# EAGLE schematic FlightControl (EAGLE 6.5.0)
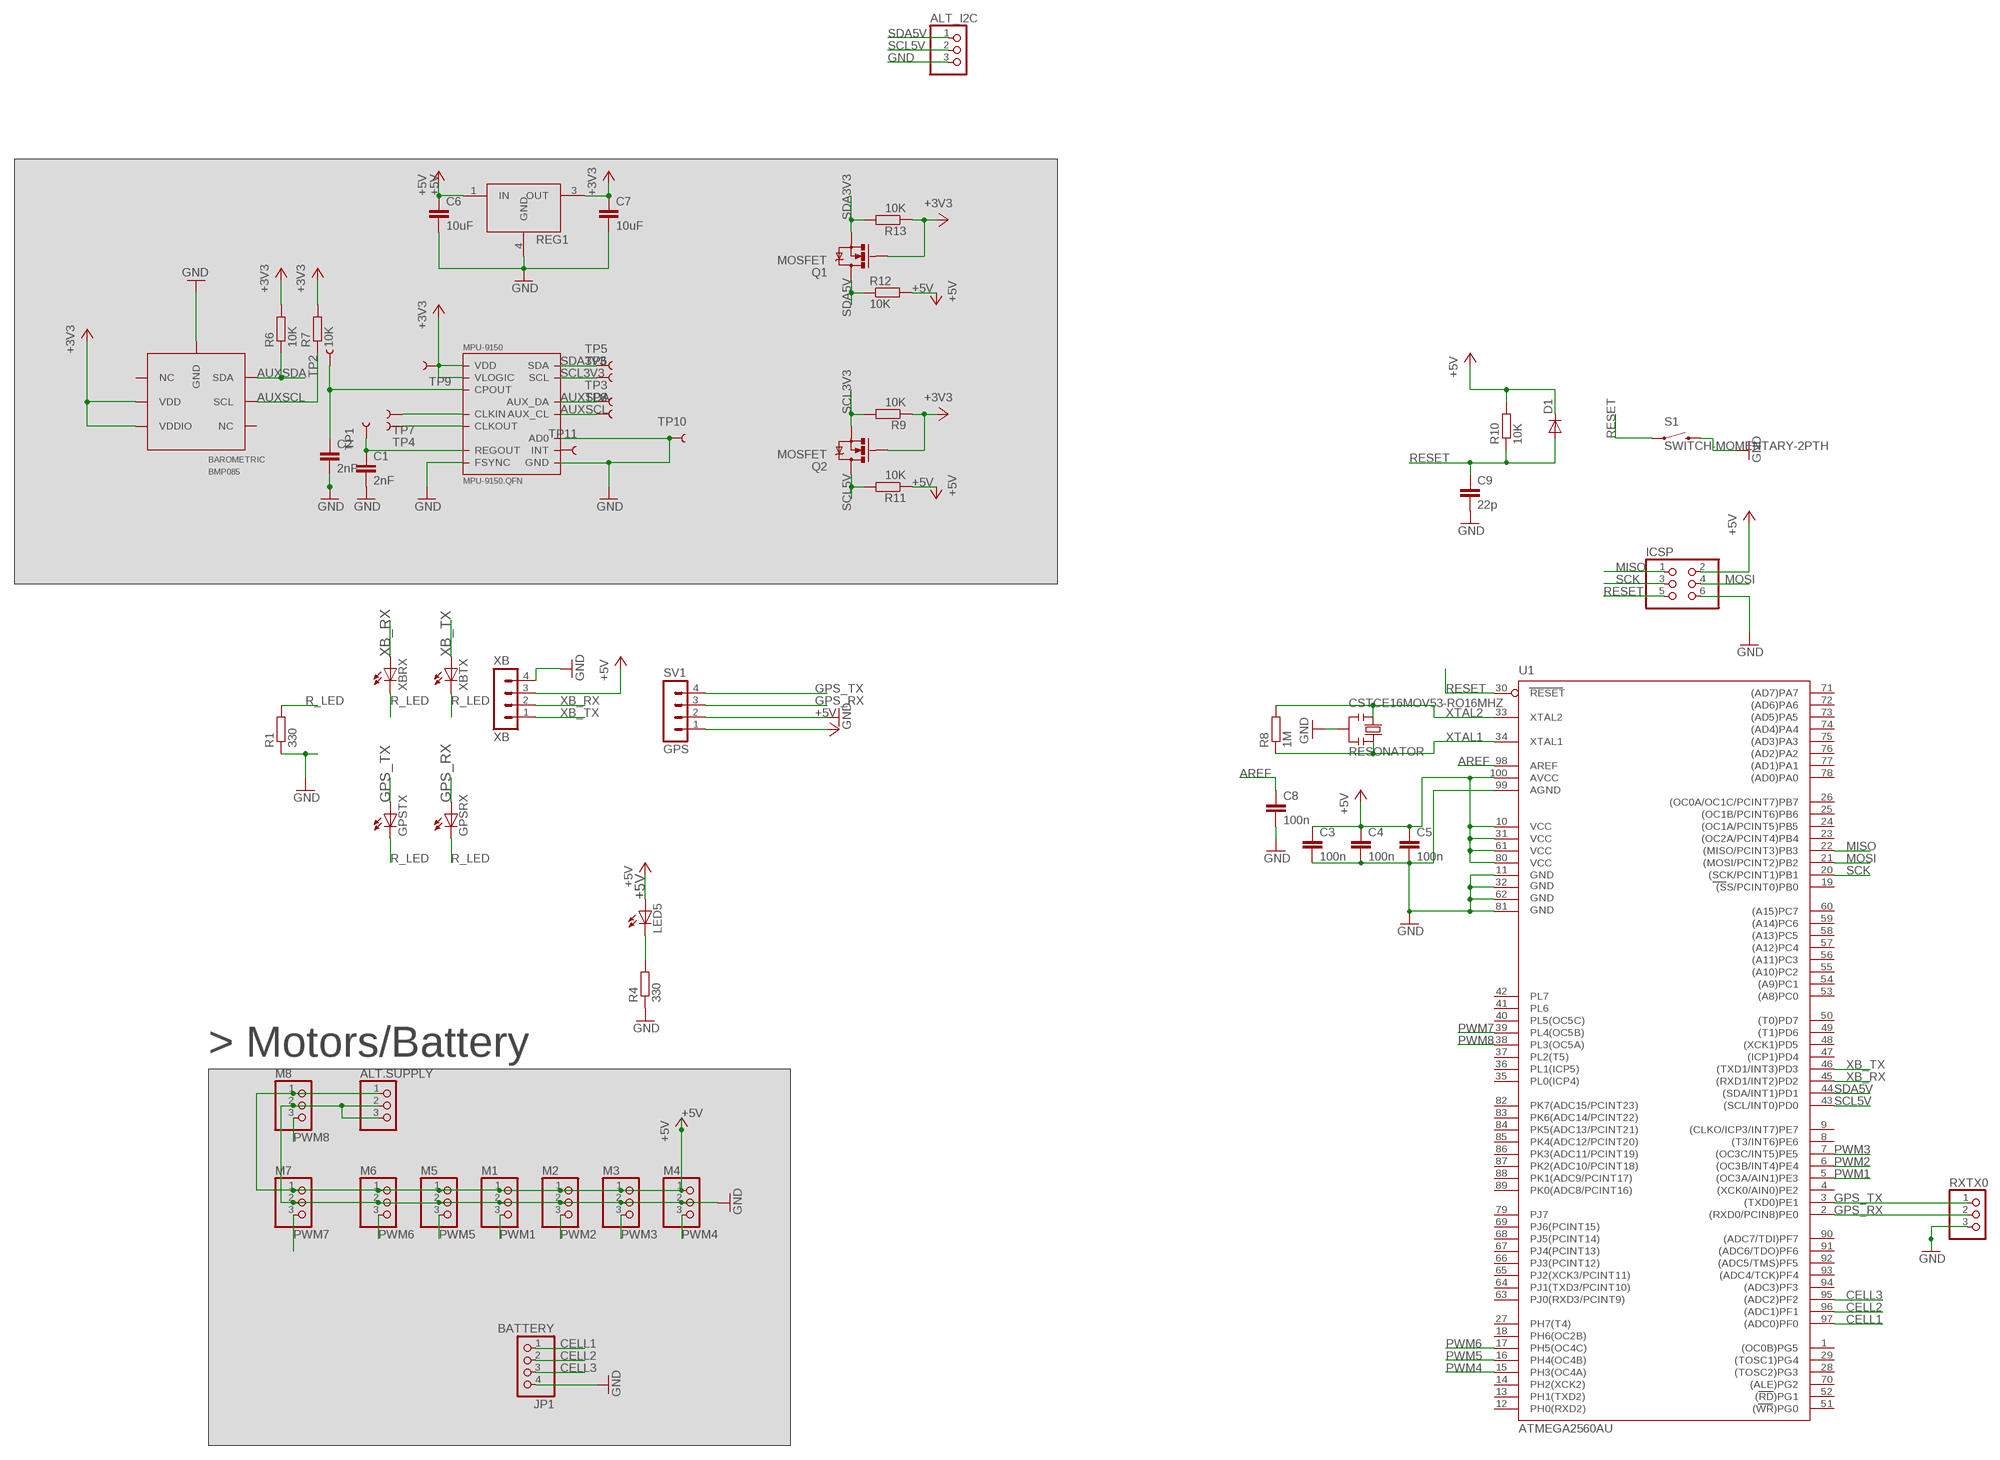
[diagram p0: schematic, sheet 1]

## Parts
ALT.SUPPLY  PINHD-1X3  [1X03]
ALT_I2C  PINHD-1X3  [1X03]
BAROMETRIC  BMP085  [7LGA]
BATTERY  JP1  PINHD-1X4  [1X04]
C1  2nF  C-EUC0603  [C0603-ROUND]
C2  2nF  C-EUC0603  [C0603-ROUND]
C3  100n  C-EU0603-RND  [C0603-ROUND]
C4  100n  C-EU0603-RND  [C0603-ROUND]
C5  100n  C-EU0603-RND  [C0603-ROUND]
C6  10uF  CAPEZ  [CAP-PTH-SMALLEZ]
C7  10uF  CAPEZ  [CAP-PTH-SMALLEZ]
C8  100n  C-EU0603-RND  [C0603-ROUND]
C9  22p  C-EU0603-RND  [C0603-ROUND]
CSTCE16MOV53-RO16MHZ  RESONATOR  RESONATORMU  [RESONATOR]
D1  DIODE-MINIMELF  [MINIMELF]
GPSRX  LEDCHIPLED_1206  [CHIPLED_1206]
GPSTX  LEDCHIPLED_1206  [CHIPLED_1206]
ICSP  PINHD-2X3  [2X03]
LED5  LEDCHIPLED_1206  [CHIPLED_1206]
M1  PINHD-1X3  [1X03]
M2  PINHD-1X3  [1X03]
M3  PINHD-1X3  [1X03]
M4  PINHD-1X3  [1X03]
M5  PINHD-1X3  [1X03]
M6  PINHD-1X3  [1X03]
M7  PINHD-1X3  [1X03]
M8  PINHD-1X3  [1X03]
MPU-9150  MPU-9150.QFN  [QFN.24.4X4]
Q1  MOSFET  MOSFET-NCHANNELBSS138  [SOT23]
Q2  MOSFET  MOSFET-NCHANNELBSS138  [SOT23]
R1  330  R-EU_0603-RND  [R0603-ROUND]
R4  330  R-EU_0603-RND  [R0603-ROUND]
R6  10K  R-EU_0603-RND  [R0603-ROUND]
R7  10K  R-EU_0603-RND  [R0603-ROUND]
R8  1M  R-EU_R0603  [R0603-ROUND]
R9  10K  R-EU_R0603  [R0603-ROUND]
R10  10K  R-EU_R0603  [R0603-ROUND]
R11  10K  R-EU_R0603  [R0603-ROUND]
R12  10K  R-EU_R0603  [R0603-ROUND]
R13  10K  R-EU_R0603  [R0603-ROUND]
REG1  LD39300  [DPAK]
RXTX0  PINHD-1X3  [1X03]
S1  SWITCH-MOMENTARY-2PTH  [TACTILE-PTH]
SV1  GPS  MA04-1  [MA04-1]
TP1  TEST-POINT3X5  [PAD.03X.05]
TP2  TEST-POINT3X5  [PAD.03X.05]
TP3  TEST-POINT3X5  [PAD.03X.05]
TP4  TEST-POINT3X5  [PAD.03X.05]
TP5  TEST-POINT3X5  [PAD.03X.05]
TP6  TEST-POINT3X5  [PAD.03X.05]
TP7  TEST-POINT3X5  [PAD.03X.05]
TP8  TEST-POINT3X5  [PAD.03X.05]
TP9  TEST-POINT3X5  [PAD.03X.05]
TP10  TEST-POINT3X5  [PAD.03X.05]
TP11  TEST-POINT3X5  [PAD.03X.05]
U1  ATMEGA2560AU  [TQFP100]
XB  XB  MA04-1  [MA04-1]
XBRX  LEDCHIPLED_1206  [CHIPLED_1206]
XBTX  LEDCHIPLED_1206  [CHIPLED_1206]

## Nets
+3V3: BAROMETRIC.2(VDD) BAROMETRIC.3(VDDIO) C7.1 MPU-9150.3(VDD) MPU-9150.8(VLOGIC) MPU-9150.13(VDD) Q1.1(G) Q2.1(G) R6.2 R7.2 R9.1 R13.1 REG1.3(OUT) TP9.P$1
+5V: ALT.SUPPLY.1 C3.1 C4.1 C5.1 C6.1 D1.C ICSP.2 LED5.A M1.1 M2.1 M3.1 M4.1 M5.1 M6.1 M7.1 M8.1 R10.2 R11.1 R12.2 REG1.1(IN) SV1.1 U1.10(VCC) U1.31(VCC1) U1.61(VCC2) U1.80(VCC3) U1.100(AVCC) XB.3
AREF: C8.1 U1.98(AREF)
AUXSCL: BAROMETRIC.5(SCL) MPU-9150.7(AUX_CL) R7.1 TP8.P$1
AUXSDA: BAROMETRIC.6(SDA) MPU-9150.6(AUX_DA) R6.1 TP3.P$1
CELL1: BATTERY.1 U1.97((ADC0)PF0)
CELL2: BATTERY.2 U1.96((ADC1)PF1)
CELL3: BATTERY.3 U1.95((ADC2)PF2)
CPOUT: C2.1 MPU-9150.20(CPOUT) TP2.P$1
GND: ALT.SUPPLY.2 ALT.SUPPLY.3 ALT_I2C.3 BAROMETRIC.7(GND) BATTERY.4 C1.2 C2.2 C3.2 C4.2 C5.2 C6.2 C7.2 C8.2 C9.2 CSTCE16MOV53-RO16MHZ.2 ICSP.6 M1.2 M2.2 M3.2 M4.2 M5.2 M6.2 M7.2 M8.2 MPU-9150.9(AD0) MPU-9150.11(FSYNC) MPU-9150.15(GND) MPU-9150.17(GND) MPU-9150.18(GND) R1.1 R4.1 REG1.4(GND) RXTX0.3 S1.3 SV1.2 TP10.P$1 U1.11(GND) U1.32(GND1) U1.62(GND2) U1.81(GND3) U1.99(AGND) XB.4
GPS_RX: GPSRX.A RXTX0.2 SV1.3 U1.2((RXD0/PCIN8)PE0)
GPS_TX: GPSTX.A RXTX0.1 SV1.4 U1.3((TXD0)PE1)
MISO: ICSP.1 U1.22((MISO/PCINT3)PB3)
MOSI: ICSP.4 U1.21((MOSI/PCINT2)PB2)
N$7: LED5.C R4.2
N$8: MPU-9150.1(CLKIN) TP7.P$1
N$9: MPU-9150.22(CLKOUT) TP4.P$1
N$10: MPU-9150.12(INT) TP11.P$1
PWM1: M1.3 U1.5((OC3A/AIN1)PE3)
PWM2: M2.3 U1.6((OC3B/INT4)PE4)
PWM3: M3.3 U1.7((OC3C/INT5)PE5)
PWM4: M4.3 U1.15(PH3(OC4A))
PWM5: M5.3 U1.16(PH4(OC4B))
PWM6: M6.3 U1.17(PH5(OC4C))
PWM7: M7.3 U1.39(PL4(OC5B))
PWM8: M8.3 U1.38(PL3(OC5A))
R_LED: GPSRX.C GPSTX.C R1.2 XBRX.C XBTX.C
REGOUT: C1.1 MPU-9150.10(REGOUT) TP1.P$1
RESET: C9.1 D1.A ICSP.5 R10.1 S1.1 U1.30(RESET)
SCK: ICSP.3 U1.20((SCK/PCINT1)PB1)
SCL3V3: MPU-9150.23(SCL) Q2.2(S) R9.2 TP6.P$1
SCL5V: ALT_I2C.2 Q2.3(D) R11.2 U1.43((SCL/INT0)PD0)
SDA3V3: MPU-9150.24(SDA) Q1.2(S) R13.2 TP5.P$1
SDA5V: ALT_I2C.1 Q1.3(D) R12.1 U1.44((SDA/INT1)PD1)
XB_RX: U1.45((RXD1/INT2)PD2) XB.2 XBRX.A
XB_TX: U1.46((TXD1/INT3)PD3) XB.1 XBTX.A
XTAL1: CSTCE16MOV53-RO16MHZ.3 R8.1 U1.34(XTAL1)
XTAL2: CSTCE16MOV53-RO16MHZ.1 R8.2 U1.33(XTAL2)
Unconnected: BAROMETRIC.1(NC) BAROMETRIC.4(NC) U1.1((OC0B)PG5) U1.4((XCK0/AIN0)PE2) U1.8((T3/INT6)PE6) U1.9((CLKO/ICP3/INT7)PE7) U1.12(PH0(RXD2)) U1.13(PH1(TXD2)) U1.14(PH2(XCK2)) U1.18(PH6(OC2B)) U1.19((SS/PCINT0)PB0) U1.23((OC2A/PCINT4)PB4) U1.24((OC1A/PCINT5)PB5) U1.25((OC1B/PCINT6)PB6) U1.26((OC0A/OC1C/PCINT7)PB7) U1.27(PH7(T4)) U1.28((TOSC2)PG3) U1.29((TOSC1)PG4) U1.35(PL0(ICP4)) U1.36(PL1(ICP5)) U1.37(PL2(T5)) U1.40(PL5(OC5C)) U1.41(PL6) U1.42(PL7) U1.47((ICP1)PD4) U1.48((XCK1)PD5) U1.49((T1)PD6) U1.50((T0)PD7) U1.51((WR)PG0) U1.52((RD)PG1) U1.53((A8)PC0) U1.54((A9)PC1) U1.55((A10)PC2) U1.56((A11)PC3) U1.57((A12)PC4) U1.58((A13)PC5) U1.59((A14)PC6) U1.60((A15)PC7) U1.63(PJ0(RXD3/PCINT9)) U1.64(PJ1(TXD3/PCINT10)) U1.65(PJ2(XCK3/PCINT11)) U1.66(PJ3(PCINT12)) U1.67(PJ4(PCINT13)) U1.68(PJ5(PCINT14)) U1.69(PJ6(PCINT15)) U1.70((ALE)PG2) U1.71((AD7)PA7) U1.72((AD6)PA6) U1.73((AD5)PA5) U1.74((AD4)PA4) U1.75((AD3)PA3) U1.76((AD2)PA2) U1.77((AD1)PA1) U1.78((AD0)PA0) U1.79(PJ7) U1.82(PK7(ADC15/PCINT23)) U1.83(PK6(ADC14/PCINT22)) U1.84(PK5(ADC13/PCINT21)) U1.85(PK4(ADC12/PCINT20)) U1.86(PK3(ADC11/PCINT19)) U1.87(PK2(ADC10/PCINT18)) U1.88(PK1(ADC9/PCINT17)) U1.89(PK0(ADC8/PCINT16)) U1.90((ADC7/TDI)PF7) U1.91((ADC6/TDO)PF6) U1.92((ADC5/TMS)PF5) U1.93((ADC4/TCK)PF4) U1.94((ADC3)PF3)

## Notes on the sheet
- > Motors/Battery

## Library data of the parts
ALT.SUPPLY ALT_I2C M1-M8 RXTX0 = pinhead:PINHD-1X3: PIN HEADER
BAROMETRIC = MyLibrary:BMP085
BATTERY = pinhead:PINHD-1X4: PIN HEADER
C1-C5 C8 C9 = SmartPrj:C-EU: CAPACITOR, European symbol
C6 C7 = SparkFun-Capacitors:CAP: Capacitor Standard 0603 ceramic capacitor, and 0.1" leaded capacitor.
CSTCE16MOV53-RO16MHZ = SmartPrj:RESONATOR
D1 = diode:DIODE-: DIODE
GPSRX GPSTX LED5 XBRX XBTX = adafruit:LED: LED OSRAM: - CHIPLED LG R971, LG N971, LY N971, LG Q971, LY Q971, LO R971, LY R971 LH N974, LH R974 LS Q976, LO Q976, LY Q976 LO Q996 - Hyper CHIPLED LW Q18S LB Q993, LB Q99A, LB R99A - SideLED LS A670, LO A670, LY A670, LG A670, LP A670 LB A673, LV A673, LT A673, LW A673 LH A674 LY A675 LS A676, LA A676, LO A676, LY A676, LW A676 LS A679, LY A679, LG A679 - Hyper Micro SIDELED® LS Y876, LA Y876, LO Y876, LY Y876 LT Y87S - SmartLED LW L88C, LW L88S LB L89C, LB L89S, LG L890 LS L89K, LO L89K, LY L89K LS L896, LA L896, LO L896, LY L896 - TOPLED LS T670, LO T670, LY T670, LG T670, LP T670 LSG T670, LSP T670, LSY T670, LOP T670, LYG T670 LG T671, LOG T671, LSG T671 LB T673, LV T673, LT T673, LW T673 LH T674 LS T676, LA T676, LO T676, LY T676, LB T676, LH T676, LSB T676, LW T676 LB T67C, LV T67C, LT T67C, LS T67K, LO T67K, LY T67K, LW E67C LS E67B, LA E67B, LO E67B, LY E67B, LB E67C, LV E67C, LT E67C LW T67C LS T679, LY T679, LG T679 LS T770, LO T770, LY T770, LG T770, LP T770 LB T773, LV T773, LT T773, LW T773 LH T774 LS E675, LA E675, LY E675, LS T675 LS T776, LA T776, LO T776, LY T776, LB T776 LHGB T686 LT T68C, LB T68C - Hyper Mini TOPLED® LB M676 - Mini TOPLED Santana® LG M470 LS M47K, LO M47K, LY M47K Source: http://www.osram.convergy.de/
ICSP = SmartPrj:PINHD-2X3: PIN HEADER
MPU-9150 = invensense:MPU-9150
Q1 Q2 = SparkFun-DiscreteSemi:MOSFET-NCHANNEL: Common NMOSFET Parts MFG P/N Store ID Prod ID FDD8780 TRANS-09984 SI7820DN TRANS-11055 FDS6630A IC-08089 2N7002PW TRANS-11151 FQP30N06L COM-10213 TRANS-10060 BSS123LT1G TRANS-08345 BSS138 TRANS-00830 BS170 2N7000; PROD_ID: TRANS-00830
R1 R4 R6-R13 = SmartPrj:R-EU_: RESISTOR, European symbol
REG1 = v-reg:LD39300
S1 = SparkFun-Electromechanical:SWITCH-MOMENTARY-2: Various NO switches- pushbuttons, reed, etc
SV1 XB = con-lstb:MA04-1: PIN HEADER; OC_FARNELL: unknown; OC_NEWARK: unknown
TP1-TP11 = SparkFun-Passives:TEST-POINT: Bare copper test points for troubleshooting or ICT
U1 = SparkFun-DigitalIC:ATMEGA2560: Atmel 100-pin 8-bit uC 64/128/256 Kbytes FLASH 4 Kbytes EEPROM 8 Kbytes SRAM 86 General Purpose I/O pins 12-channels16-bit PWM 4 x Serial USARTs 16-channels 10-bit A/D

## Net classes
0 default: clearance 0.205 mm